# EAGLE schematic Team18_V1 (EAGLE 9.3.0)
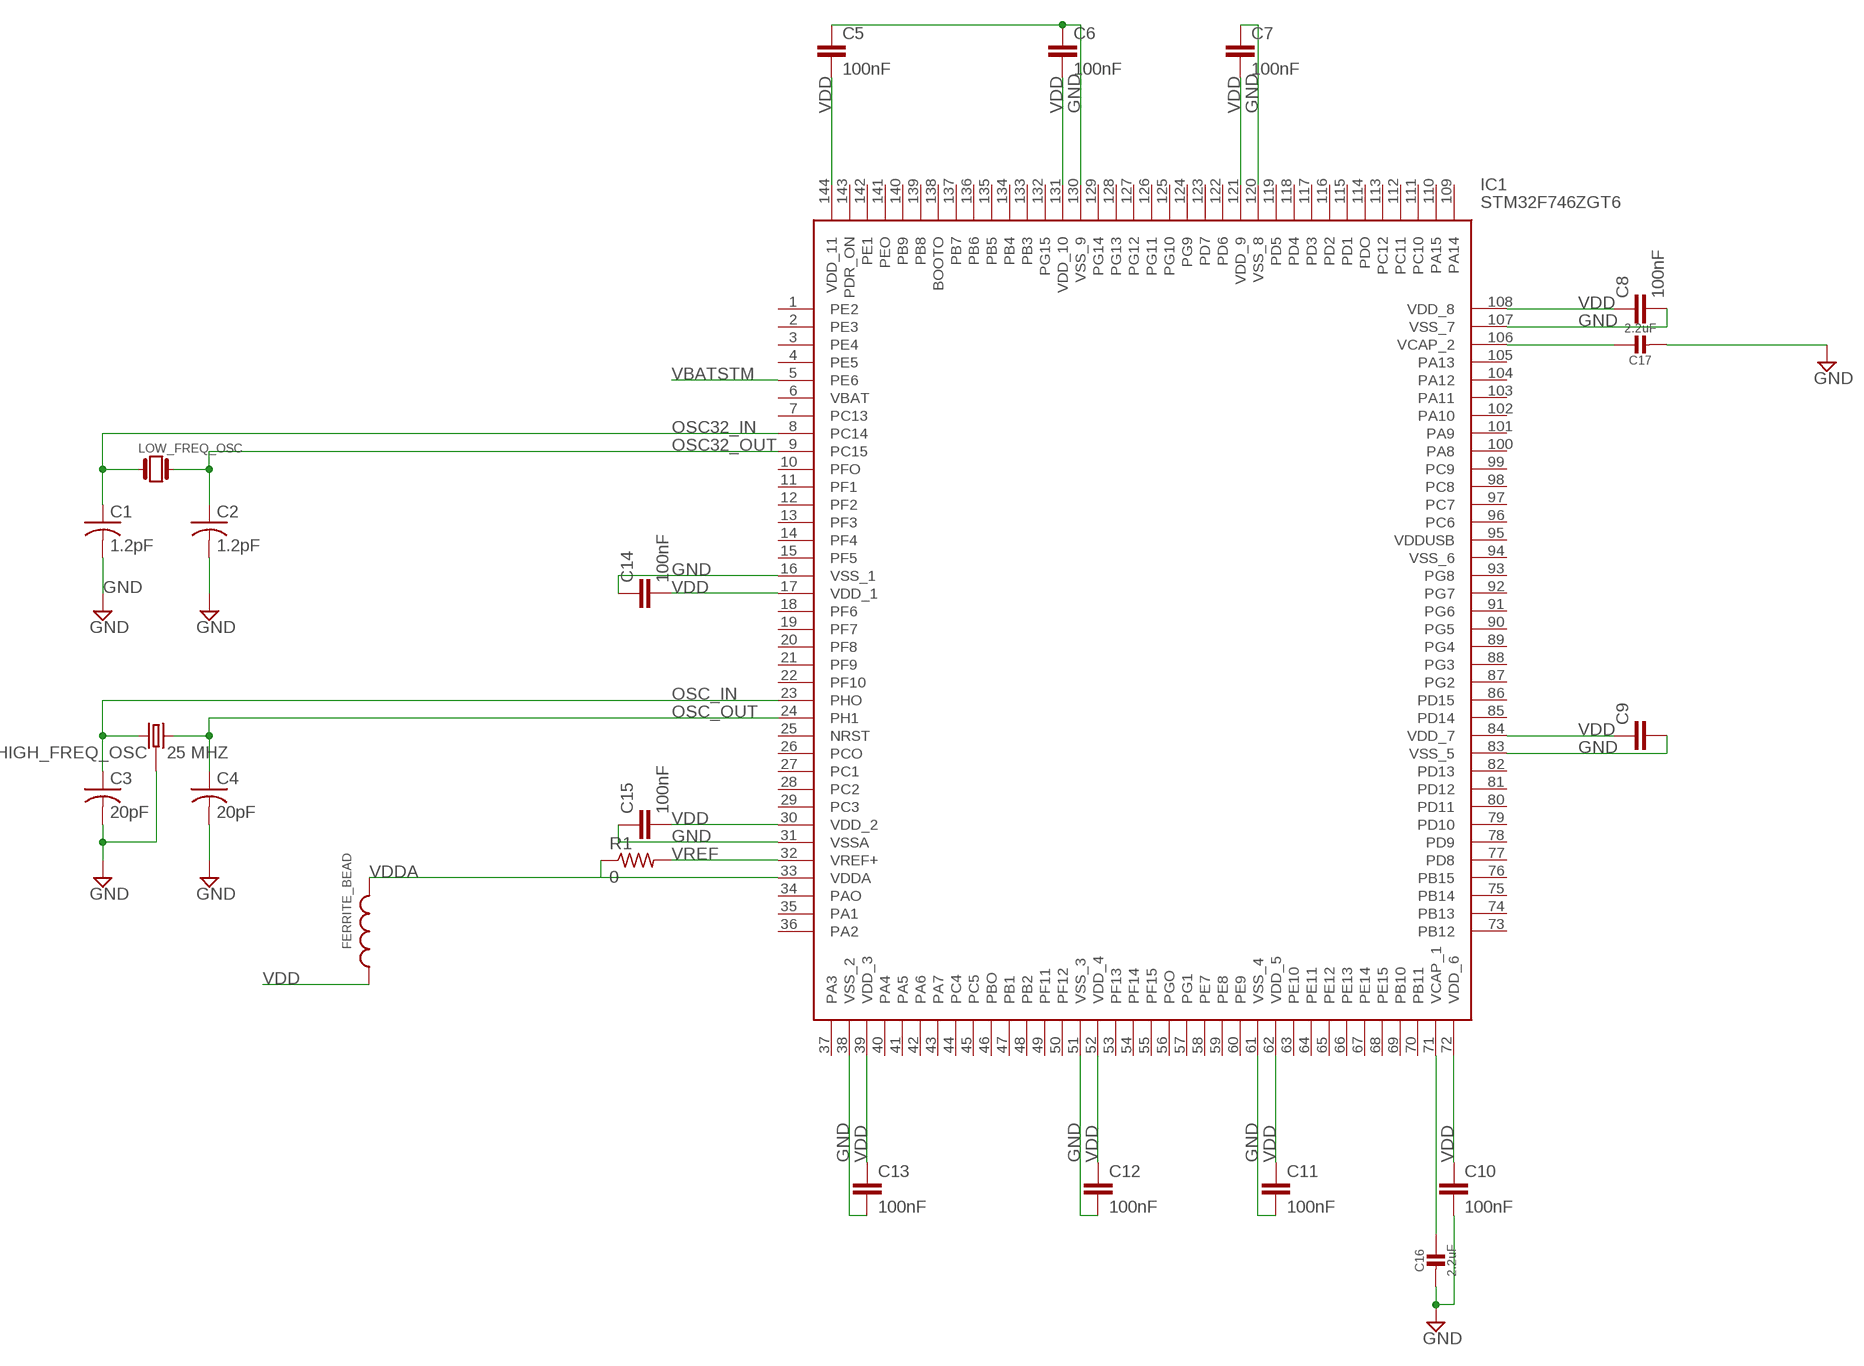
[diagram p0: schematic, sheet 1, part 1 of 2]
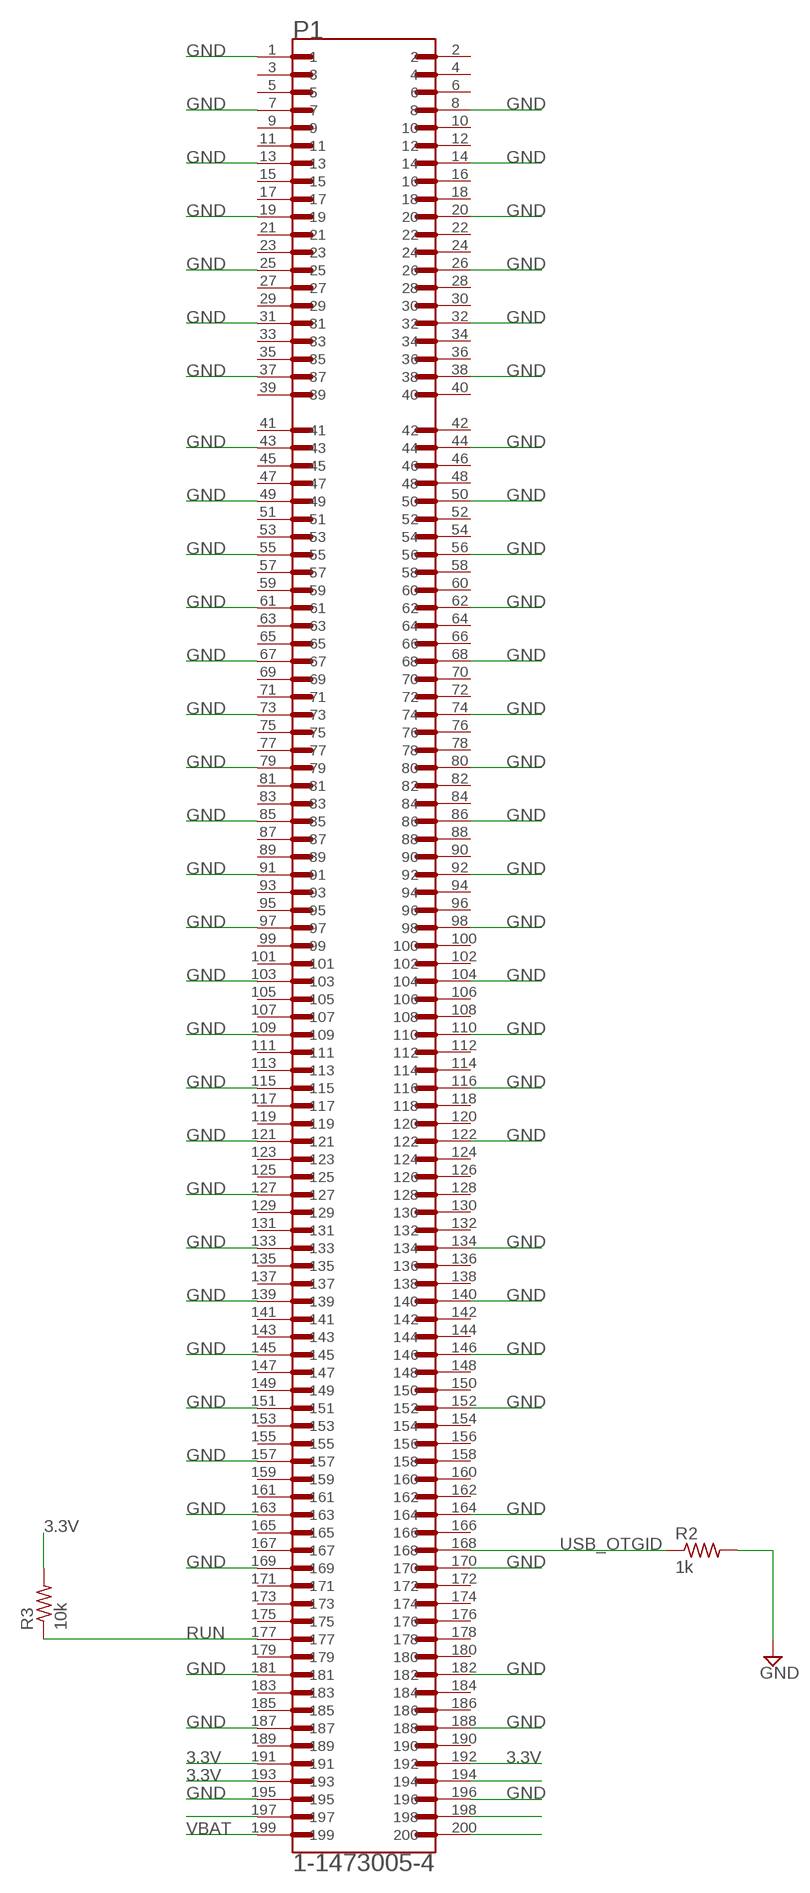
[diagram p1: schematic, sheet 1, part 2 of 2]

## Parts
C1  1.2pF  C-USC0805  [C0805]
C2  1.2pF  C-USC0805  [C0805]
C3  20pF  C-USC0805  [C0805]
C4  20pF  C-USC0805  [C0805]
C5  100nF  C-EUC0805  [C0805]
C6  100nF  C-EUC0805  [C0805]
C7  100nF  C-EUC0805  [C0805]
C8  100nF  C-EUC0805  [C0805]
C9  C-EUC0805  [C0805]
C10  100nF  C-EUC0805  [C0805]
C11  100nF  C-EUC0805  [C0805]
C12  100nF  C-EUC0805  [C0805]
C13  100nF  C-EUC0805  [C0805]
C14  100nF  C-EUC0805  [C0805]
C15  100nF  C-EUC0805  [C0805]
C16  2.2uF  CAP_CERAMIC0805-NOOUTLINE  [0805-NO]
C17  2.2uF  CAP_CERAMIC0805-NOOUTLINE  [0805-NO]
FERRITE_BEAD  WE-CBA_0805_782853112_HC  [WE-CBA_0805(W=4)]
HIGH_FREQ_OSC  25 MHZ  CRYSTAL-26MHZSMD-3.2X2.5  [CRYSTAL-SMD-3.2X2.5MM]
IC1  STM32F746ZGT6  [QFP50P2200X2200X160-144N]
LOW_FREQ_OSC  GENERIC-CRYSTAL_FC135  [FC135]
P1  1-1473005-4  [TE_1-1473005-4]
R1  0  R-US_R0805  [R0805]
R2  1k  R-US_R0805  [R0805]
R3  10k  R-US_R0805  [R0805]

## Nets
3.3V: P1.191 P1.192 P1.193 P1.194 R3.2
GND: C1.2 C2.2 C3.2 C4.2 C5.1 C6.1 C7.1 C8.2 C9.2 C10.2 C11.2 C12.2 C13.2 C14.1 C15.1 C16.2 C17.2 HIGH_FREQ_OSC.2 HIGH_FREQ_OSC.4 IC1.16(VSS_1) IC1.31(VSSA) IC1.38(VSS_2) IC1.51(VSS_3) IC1.61(VSS_4) IC1.83(VSS_5) IC1.107(VSS_7) IC1.120(VSS_8) IC1.130(VSS_9) P1.1 P1.7 P1.8 P1.13 P1.14 P1.19 P1.20 P1.25 P1.26 P1.31 P1.32 P1.37 P1.38 P1.43 P1.44 P1.49 P1.50 P1.55 P1.56 P1.61 P1.62 P1.67 P1.68 P1.73 P1.74 P1.79 P1.80 P1.85 P1.86 P1.91 P1.92 P1.97 P1.98 P1.103 P1.104 P1.109 P1.110 P1.115 P1.116 P1.121 P1.122 P1.127 P1.133 P1.134 P1.139 P1.140 P1.145 P1.146 P1.151 P1.152 P1.157 P1.163 P1.164 P1.169 P1.170 P1.181 P1.182 P1.187 P1.188 P1.195 P1.196 R2.2
N$1: C16.1 IC1.71(VCAP_1)
N$2: C17.1 IC1.106(VCAP_2)
OSC32_IN: C1.1 IC1.8(PC14) LOW_FREQ_OSC.X1
OSC32_OUT: C2.1 IC1.9(PC15) LOW_FREQ_OSC.X2
OSC_IN: C3.1 HIGH_FREQ_OSC.1 IC1.23(PHO)
OSC_OUT: C4.1 HIGH_FREQ_OSC.3 IC1.24(PH1)
RUN: P1.177 R3.1
USB_OTGID: P1.168 R2.1
VBAT: P1.197 P1.198 P1.199 P1.200
VBATSTM: IC1.5(PE6)
VDD: C5.2 C6.2 C7.2 C8.1 C9.1 C10.1 C11.1 C12.1 C13.1 C14.2 C15.2 FERRITE_BEAD.1 IC1.17(VDD_1) IC1.30(VDD_2) IC1.39(VDD_3) IC1.52(VDD_4) IC1.62(VDD_5) IC1.72(VDD_6) IC1.84(VDD_7) IC1.108(VDD_8) IC1.121(VDD_9) IC1.131(VDD_10) IC1.144(VDD_11)
VDDA: FERRITE_BEAD.2 IC1.33(VDDA) R1.1
VREF: IC1.32(VREF+) R1.2
Unconnected: IC1.1(PE2) IC1.2(PE3) IC1.3(PE4) IC1.4(PE5) IC1.6(VBAT) IC1.7(PC13) IC1.10(PFO) IC1.11(PF1) IC1.12(PF2) IC1.13(PF3) IC1.14(PF4) IC1.15(PF5) IC1.18(PF6) IC1.19(PF7) IC1.20(PF8) IC1.21(PF9) IC1.22(PF10) IC1.25(NRST) IC1.26(PCO) IC1.27(PC1) IC1.28(PC2) IC1.29(PC3) IC1.34(PAO) IC1.35(PA1) IC1.36(PA2) IC1.37(PA3) IC1.40(PA4) IC1.41(PA5) IC1.42(PA6) IC1.43(PA7) IC1.44(PC4) IC1.45(PC5) IC1.46(PBO) IC1.47(PB1) IC1.48(PB2) IC1.49(PF11) IC1.50(PF12) IC1.53(PF13) IC1.54(PF14) IC1.55(PF15) IC1.56(PGO) IC1.57(PG1) IC1.58(PE7) IC1.59(PE8) IC1.60(PE9) IC1.63(PE10) IC1.64(PE11) IC1.65(PE12) IC1.66(PE13) IC1.67(PE14) IC1.68(PE15) IC1.69(PB10) IC1.70(PB11) IC1.73(PB12) IC1.74(PB13) IC1.75(PB14) IC1.76(PB15) IC1.77(PD8) IC1.78(PD9) IC1.79(PD10) IC1.80(PD11) IC1.81(PD12) IC1.82(PD13) IC1.85(PD14) IC1.86(PD15) IC1.87(PG2) IC1.88(PG3) IC1.89(PG4) IC1.90(PG5) IC1.91(PG6) IC1.92(PG7) IC1.93(PG8) IC1.96(PC6) IC1.97(PC7) IC1.98(PC8) IC1.99(PC9) IC1.100(PA8) IC1.101(PA9) IC1.102(PA10) IC1.103(PA11) IC1.104(PA12) IC1.105(PA13) IC1.109(PA14) IC1.110(PA15) IC1.111(PC10) IC1.112(PC11) IC1.113(PC12) IC1.114(PDO) IC1.115(PD1) IC1.116(PD2) IC1.117(PD3) IC1.118(PD4) IC1.119(PD5) IC1.122(PD6) IC1.123(PD7) IC1.124(PG9) IC1.125(PG10) IC1.126(PG11) IC1.127(PG12) IC1.128(PG13) IC1.129(PG14) IC1.132(PG15) IC1.133(PB3) IC1.134(PB4) IC1.135(PB5) IC1.136(PB6) IC1.137(PB7) IC1.138(BOOTO) IC1.139(PB8) IC1.140(PB9) IC1.141(PEO) IC1.142(PE1) IC1.143(PDR_ON) P1.2 P1.3 P1.4 P1.5 P1.6 P1.9 P1.10 P1.11 P1.12 P1.15 P1.16 P1.17 P1.18 P1.21 P1.22 P1.23 P1.24 P1.27 P1.28 P1.29 P1.30 P1.33 P1.34 P1.35 P1.36 P1.39 P1.40 P1.41 P1.42 P1.45 P1.46 P1.47 P1.48 P1.51 P1.52 P1.53 P1.54 P1.57 P1.58 P1.59 P1.60 P1.63 P1.64 P1.65 P1.66 P1.69 P1.70 P1.71 P1.72 P1.75 P1.76 P1.77 P1.78 P1.81 P1.82 P1.83 P1.84 P1.87 P1.88 P1.89 P1.90 P1.93 P1.94 P1.95 P1.96 P1.99 P1.100 P1.101 P1.102 P1.105 P1.106 P1.107 P1.108 P1.111 P1.112 P1.113 P1.114 P1.117 P1.118 P1.119 P1.120 P1.123 P1.124 P1.125 P1.126 P1.128 P1.129 P1.130 P1.131 P1.132 P1.135 P1.136 P1.137 P1.138 P1.141 P1.142 P1.143 P1.144 P1.147 P1.148 P1.149 P1.150 P1.153 P1.154 P1.155 P1.156 P1.158 P1.159 P1.160 P1.161 P1.162 P1.165 P1.166 P1.167 P1.171 P1.172 P1.173 P1.174 P1.175 P1.176 P1.178 P1.179 P1.180 P1.183 P1.184 P1.185 P1.186 P1.189 P1.190

## Power pins joined to a net without a drawn wire
VDDUSB: IC1.95(VDDUSB)
VSS_6: IC1.94(VSS_6)

## Library data of the parts
C1-C4 = adafruit:C-US: CAPACITOR, American symbol
C5-C15 = rcl:C-EU: CAPACITOR, European symbol; SPICEPREFIX: C
C16 C17 = audio amplifier example:CAP_CERAMIC
FERRITE_BEAD = Wurth_Elektronik_Passive_rev18f:WE-CBA_0805: WE-CBA SMD EMI Suppression Ferrite Bead Characteristics Reliable Ni-Sn electrodes High rated current up to 5A Recommended soldering: Reflow Operating temperature: -55°C to +125°C Applications * Perfect as data line filter and for uncoupling of distribution voltage *This special SMD chip bead ferrites can be put directly on the printed circuit board. They offer excellent anti-EMI properties and low DC-resistance. Placed very close next to the interference source even with smallest size 0402,maximal impedance at 1000 Ω can be reached. *High Speed: "High Speed " SMD ferrites WE-CBF have lower impedance in the lower frequency ranges thus they have only a low attenuation for fast signals. Application e.g. USB 2.0, IEEE 1394,LVDS *Wide Band: "Wide Band" SMD ferrites WE-CBF already show high impedance in low frequency range. Therefore they are wide band through the whole spectrum. Application e.g. control signats, RS232, RS422, DC/DC converter *High Current: "High Current " SMD ferrites WE-CBF are designed for high current (over 1 A). The rated current refers to 40K self-heating. High current SMD ferrites are available in all there types (High Speed, Wide Band and High Frequency). Application e.g. power supply, DC/DC converter *Advice: Pay attention for the use of SMD-Ferrites for high current>1A and ambient temperature over +85°C that the rated current has to be reduced when temperature is above +85°C (Derating). *At+100°C environment temperature the maximal rated current has to add up to only 60% of the data sheet value ,without an overload of the component. Variant abbreviation WB means WIDE BAND HS means HIGH SPEED HC means HIGH CURRENT <http://katalog.we-online.de/media/images/v2/Family_WE-CBA.jpg> Details see: http://katalog.we-online.de/en/pbs/WE-CBA/ Created: 2015-02-02 2015 (C) Wurth Elektronik
HIGH_FREQ_OSC = SparkFun-Clocks:CRYSTAL-26MHZ: 26MHz Crystal w/ Ground Pin Digikey Example <http://www.digikey.com/product-detail/en/epson/TSX-3225%2026.0000MF09Z-AC3/SER3627CT-ND/1802878> Frequency: 26MHz Frequency Stability: ±9ppm Frequency Tolerance: ±10ppm Load Capacitance: 9pF SparkFun Products: SparkFun ESP32 Thing <https://www.sparkfun.com/products/13907> SparkFun ESP8266 Thing Dev Board <https://www.sparkfun.com/products/13711>; PROD_ID: XTAL-12454
IC1 = 477_LIBRARY:STM32F746ZGT6: ARM Microcontrollers - MCU High-performance and DSP with FPU, ARM Cortex-M7 MCU with 1 Mbytes Flash, 200 MHz CPU, Art Accelerator, L1 cache, SDRAM Source: Datasheet <http://docs-emea.rs-online.com/webdocs/13fb/0900766b813fbe9b.pdf>; DESCRIPTION: ARM Microcontrollers - MCU High-performance and DSP with FPU, ARM Cortex-M7 MCU with 1 Mbytes Flash, 200 MHz CPU, Art Accelerator, L1 cache, SDRAM; HEIGHT: 1.6mm; MANUFACTURER_NAME: STMicroelectronics; MANUFACTURER_PART_NUMBER: STM32F746ZGT6; MOUSER_PART_NUMBER: 511-STM32F746ZGT6; MOUSER_PRICE-STOCK: https://www.mouser.com/Search/Refine.aspx?Keyword=511-STM32F746ZGT6; RS_PART_NUMBER: 8820290; RS_PRICE-STOCK: http://uk.rs-online.com/web/p/products/8820290
LOW_FREQ_OSC = mbed-HDK-Oscillator:GENERIC-CRYSTAL: GENERIC Crystal
P1 = Rpi-DDR2:1-1473005-4: Conn SO DIMM Socket SKT 200 POS 0.6mm Solder RA SMD Tray; AVAILABILITY: Unavailable; CENTERLINE_PITCH: .6 mm[.024 in]; COMMENT: 1-1473005-4; DESCRIPTION: SEMI-HARD TRAY DDR2 SODIMM SOCKET 200P 5; MF: TE Connectivity; MP: 1-1473005-4; NUMBER_OF_POSITIONS: 200; PACKAGE: None; PRICE: None; PRODUCT_TYPE: Socket; TE_PURCHASE_URL: https://www.te.com/usa-en/product-1-1473005-4.html?te_bu=Cor&te_type=disp&te_campaign=seda_glo_cor-seda-global-disp-prtnr-fy19-seda-model-bom-cta_sma-317_1&elqCampaignId=32493
R1-R3 = audio amplifier example:R-US_: RESISTOR, American symbol